# EAGLE design rapidshark-usb-breakout-mk-1.2 (EAGLE 7.5.0)
AUTHOR: sean@yak.net
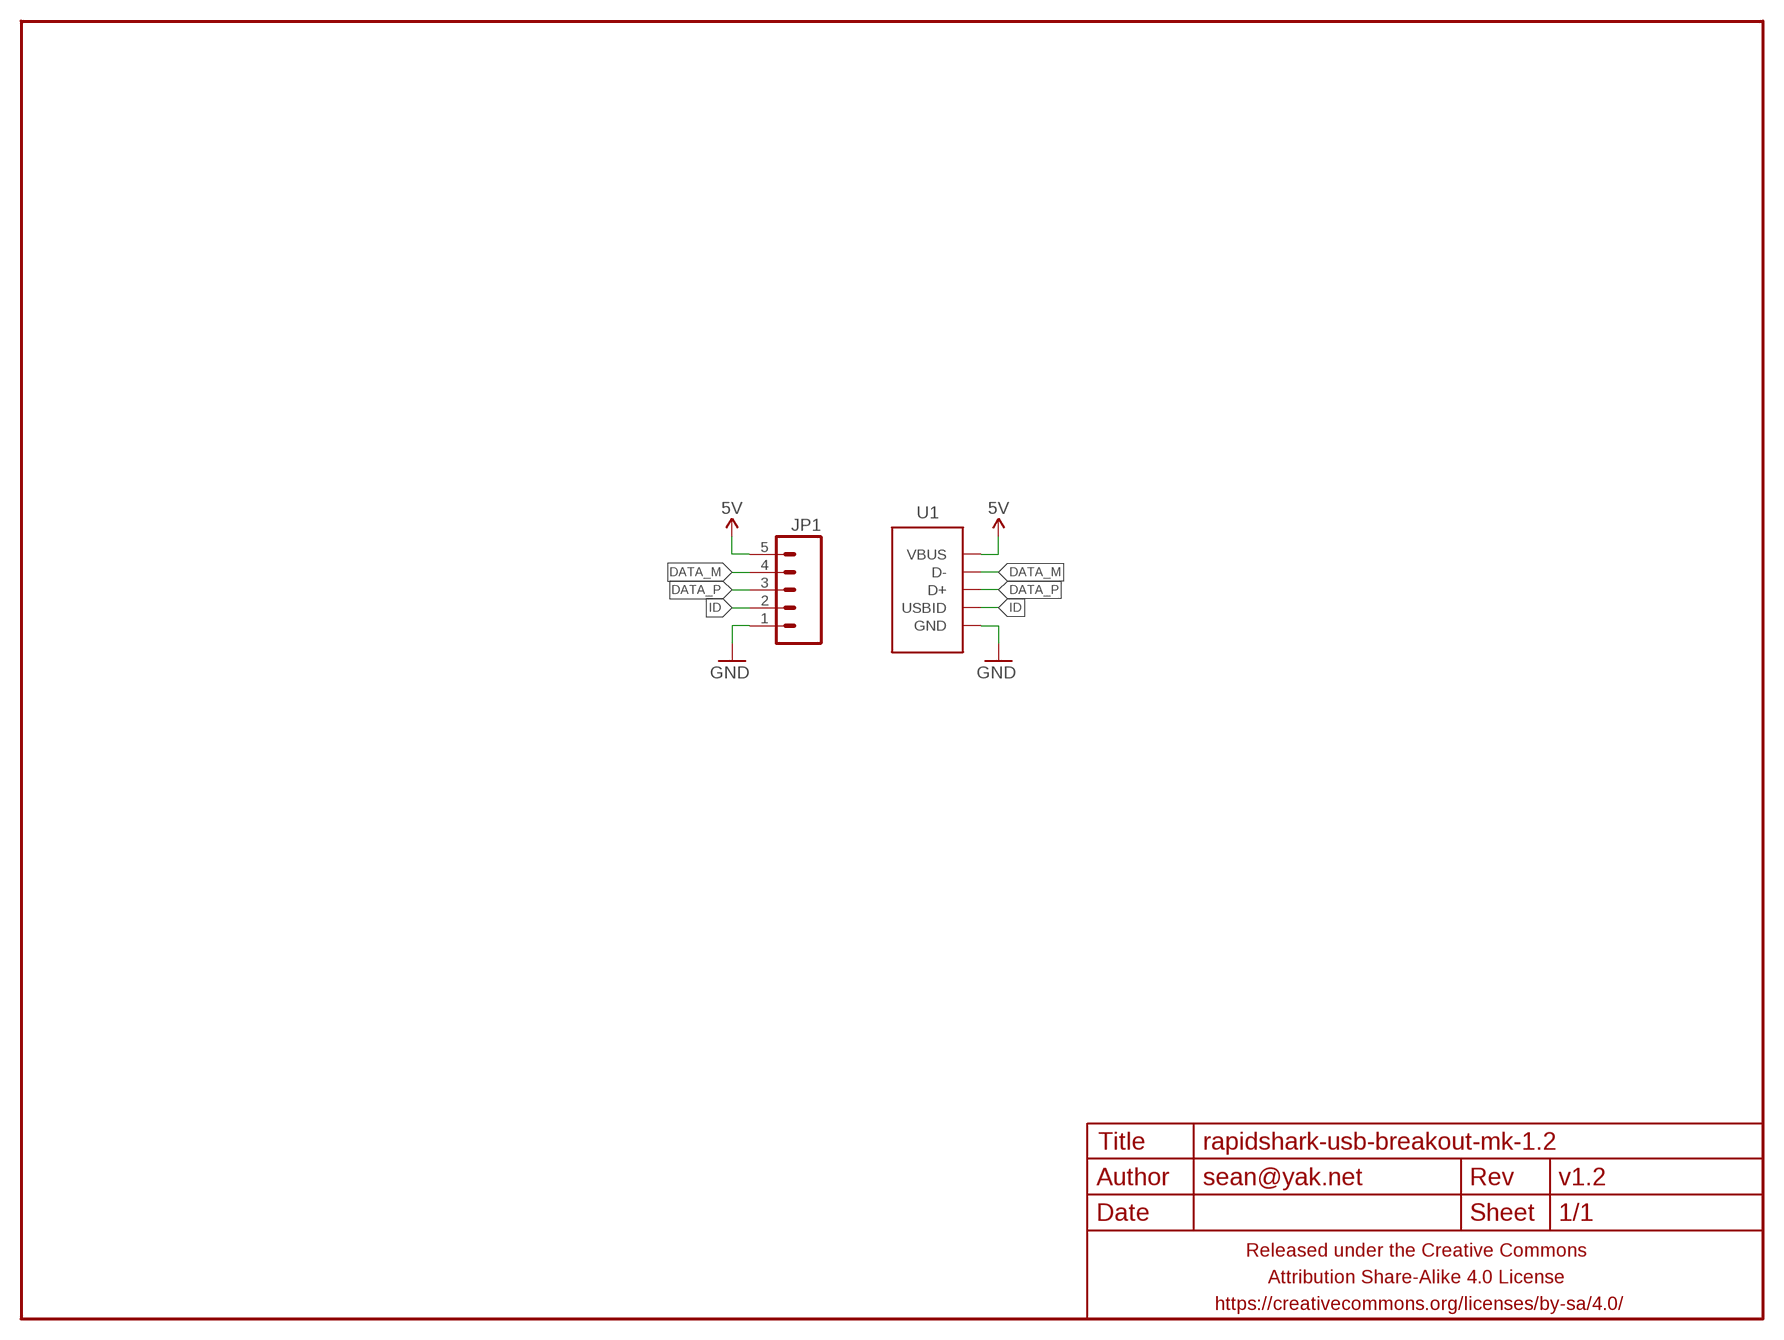
[diagram p0: schematic, sheet 1]

## Parts
FRAME1  FRAME-LETTERNO_PACKAGE  [DUMMY]
JP1  M05PTH-CENTERED  [1X05_PTH_CENTERED]
U1  USB-ABADAFRUIT_PANEL_MOUNT  [ADAFRUIT_USB_PANEL_MOUNT]

## Nets
5V: JP1.5 U1.5(VBUS)
DATA_M: JP1.4 U1.4(D-)
DATA_P: JP1.3 U1.3(D+)
GND: JP1.1 U1.1(GND)
ID: JP1.2 U1.2(USBID)

## Library data of the parts
FRAME1 = a_parts:FRAME-LETTER: Schematic Frame Standard 8.5x11 US Letter frame; DESIGNER: sean@yak.net; VERSION: v1.2
JP1 = a_parts:M05: Header 5 Standard 5-pin 0.1" header. Use with straight break away headers (SKU : PRT-00116), right angle break away headers (PRT-00553), swiss pins (PRT-00743), machine pins (PRT-00117), and female headers (PRT-00115). Molex polarized connector foot print use with SKU : PRT-08230 with associated crimp pins and housings.
U1 = a_parts:USB-AB: This is a USB AB connector that is compatible with USB OTG. i.e. this connector can serve as a host or device

## Board
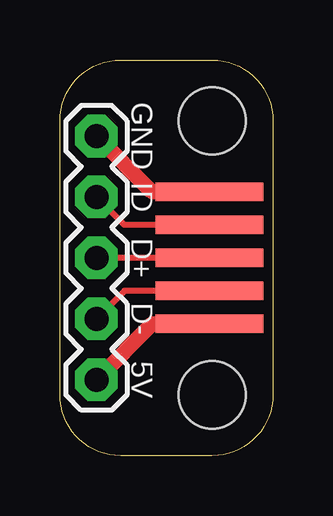
[diagram p1: board, top side]
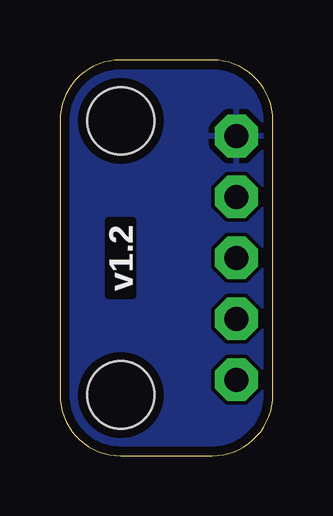
[diagram p2: board, bottom side, seen from below]

Size 8.89 x 16.51 mm. Coordinates in mm from the lower left corner, seen from the top.
Outline: 2.54,16.51 6.35,16.51 arc-90 8.89,13.97 8.89,2.54 arc-90 6.35,0 2.54,0 arc-90 0,2.54 0,13.97 arc-90 2.54,16.51
Copper layers (1*16): Top 0.0356mm / dielectric 1.5011mm / Bottom 0.0356mm
Design rules "LaenPCBOrder_2": minimum track width 6mil, minimum drill 13mil, track to track 6mil, track to pad 6mil, pad to pad 6mil, via to via 6mil, smd to smd 6mil, copper to edge 15mil, drill to drill 6mil, minimum pad ring 7mil, minimum via ring 7mil, stop-mask expansion 3mil, vias tented up to drill 20mil, thermal gap 10mil
Holes 2.8 mm at 6.35,2.54 6.35,13.97

### Footprints (pad centres in the part's own frame; a part is rotated, then mirrored left to right if it is on the bottom)
1X05_PTH_CENTERED = drill 1 pad 1.778 octagon: 1 -5.08,0; 2 -2.54,0; 3 0,0; 4 2.54,0; 5 5.08,0
ADAFRUIT_USB_PANEL_MOUNT = smd 0.762 x 4.5: 1 -2.75,-1.27; 2 -1.375,-1.27; 3 0,-1.27; 4 1.375,-1.27; 5 2.75,-1.27

### Placement (x,y rotation side)
FRAME1  0,0 270 bottom
JP1  1.52,8.26 270 top
U1  7.52,8.26 270 top

### Tracks (layer width: path | path; a pad name or v marks a point on that pad's centre or on a via)
5V
  Top 0.635: U1.5 3.85,5.5 JP1.5
DATA_M
  Top 0.254: U1.4 2.69,6.88 JP1.4
DATA_P
  Top 0.254: U1.3 JP1.3
GND
  Top 0.635: U1.1 3.85,11.01 JP1.1
  pour Bottom (rank 6): 2.54,16.51 6.35,16.51 arc-90 8.89,13.97 8.89,2.54 arc-90 6.35,0 2.54,0 arc-90 0,2.54 0,13.97 arc-90
ID
  Top 0.254: U1.2 2.69,9.63 JP1.2

### Text on the board
tPlace: GND | ID | D+ | D- | 5V